# EasyEDA schematic SCH_SecureGuardianDevice_2024-06-15.json
TITLE: PROTO V1; REV: 1.0; Date: 2024-06-05; Sheet: 1/1; Drawn By: Telmo MIguel; Company: SECURE GUARDIAN DEVICE
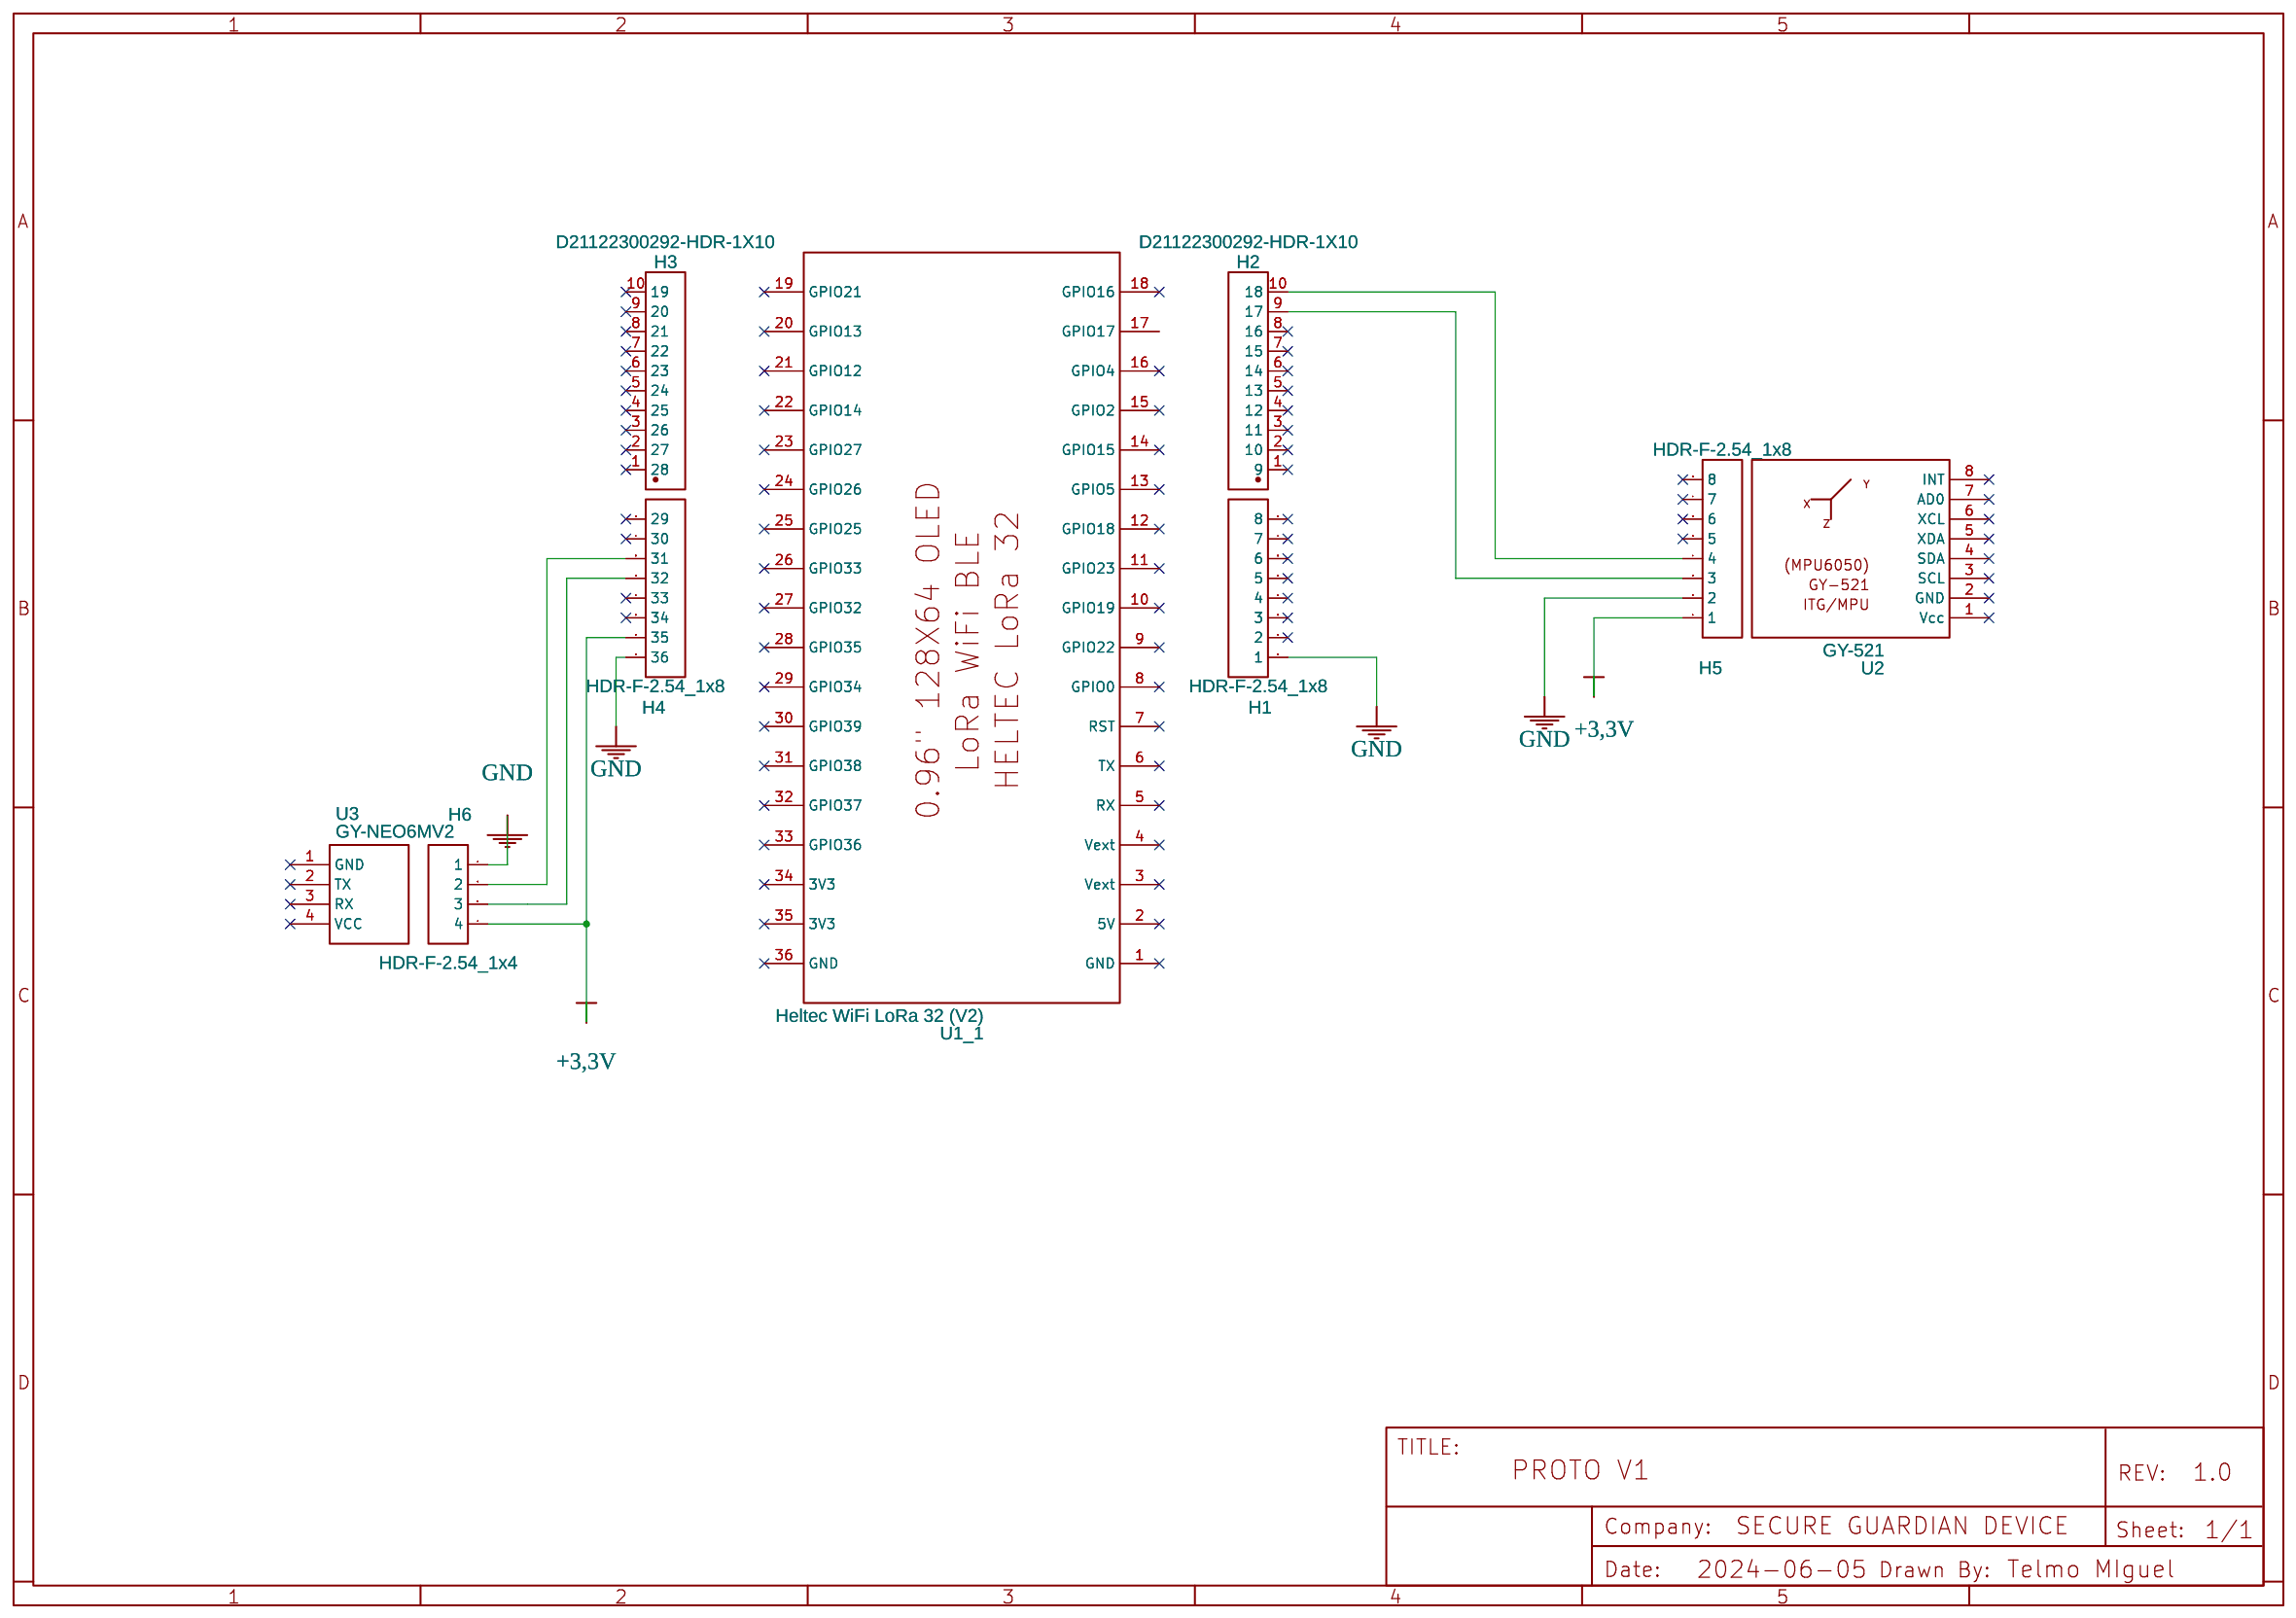
[diagram p0: schematic sheet]

## Parts
H1  HDR-F-2.54_1x8  [HDR-F-2.54_1X8]
H2  D21122300292-HDR-1X10  [HDR-F-2.54_1X10]
H3  D21122300292-HDR-1X10  [HDR-F-2.54_1X10]
H4  HDR-F-2.54_1x8  [HDR-F-2.54_1X8]
H5  HDR-F-2.54_1x8  [HDR-F-2.54_1X8]
H6  HDR-F-2.54_1x4  [HDR-F-2.54_1X4]
U1_1  Heltec WiFi LoRa 32 (V2)  [HELTEC-LORA32-WIFI-BLE-OLED]
U2  GY-521  [HDR-F-2.54_1X8]
U3  GY-NEO6MV2  [HDR-F-2.54_1X4]

## Library data of the parts
H1 H4 H5 = HDR-F-2.54_1x8: Supplier Part: C225505; Supplier: LCSC; Contributor: Peter Bontinck
H2 H3 = D21122300292-HDR-1X10: Contributor: LCSC; Supplier: LCSC; Supplier Part: C9900004880; Manufacturer: null
H6 = HDR-F-2.54_1x4: Supplier Part: C225501; Supplier: LCSC; Contributor: Damien Norris
U1_1 = Heltec WiFi LoRa 32 (V2): Manufacturer: Heltec; Manufacturer Part: Heltec WiFi LoRa 32(V2); Supplier: Heltec; Supplier Part: Heltec WiFi LoRa 32(V2); link: https://heltec.org/project/wifi-lora-32/; Contributor: romain.choulot
U2 = GY-521: Contributor: Юрий Владимирович (Duck Duck)
U3 = GY-NEO6MV2: Contributor: khanatuch7

## Nets
GND: H1.1 H4.1(36) H5.2 H6.1
+3,3V: H4.2(35) H5.1 H6.4
Net-(H2-9): H2.9(17) H5.3
Net-(H2-10): H2.10(18) H5.4
Net-(H4-5): H4.5(32) H6.3
Net-(H4-6): H4.6(31) H6.2

Not connected (* = marked no-connect by the designer): H1 2* 3* 4* 5* 6* 7* 8*; H2 1(9)* 2(10)* 3(11)* 4(12)* 5(13)* 6(14)* 7(15)* 8(16)*; H3 1(28)* 2(27)* 3(26)* 4(25)* 5(24)* 6(23)* 7(22)* 8(21)* 9(20)* 10(19)*; H4 3(34)* 4(33)* 7(30)* 8(29)*; H5 5* 6* 7* 8*; U1_1 1(GND)* 2(5V)* 3(Vext)* 4(Vext)* 5(RX)* 6(TX)* 7(RST)* 8(GPIO0)* 9(GPIO22)* 10(GPIO19)* 11(GPIO23)* 12(GPIO18)* 13(GPIO5)* 14(GPIO15)* 15(GPIO2)* 16(GPIO4)* 17(GPIO17) 18(GPIO16)* 19(GPIO21)* 20(GPIO13)* 21(GPIO12)* 22(GPIO14)* 23(GPIO27)* 24(GPIO26)* 25(GPIO25)* 26(GPIO33)* 27(GPIO32)* 28(GPIO35)* 29(GPIO34)* 30(GPIO39)* 31(GPIO38)* 32(GPIO37)* 33(GPIO36)* 34(3V3)* 35(3V3)* 36(GND)*; U2 1(Vcc)* 2(GND)* 3(SCL)* 4(SDA)* 5(XDA)* 6(XCL)* 7(AD0)* 8(INT)*; U3 1(GND)* 2(TX)* 3(RX)* 4(VCC)*
